# EAGLE design breakout_da14580 (EAGLE 7.4.0)
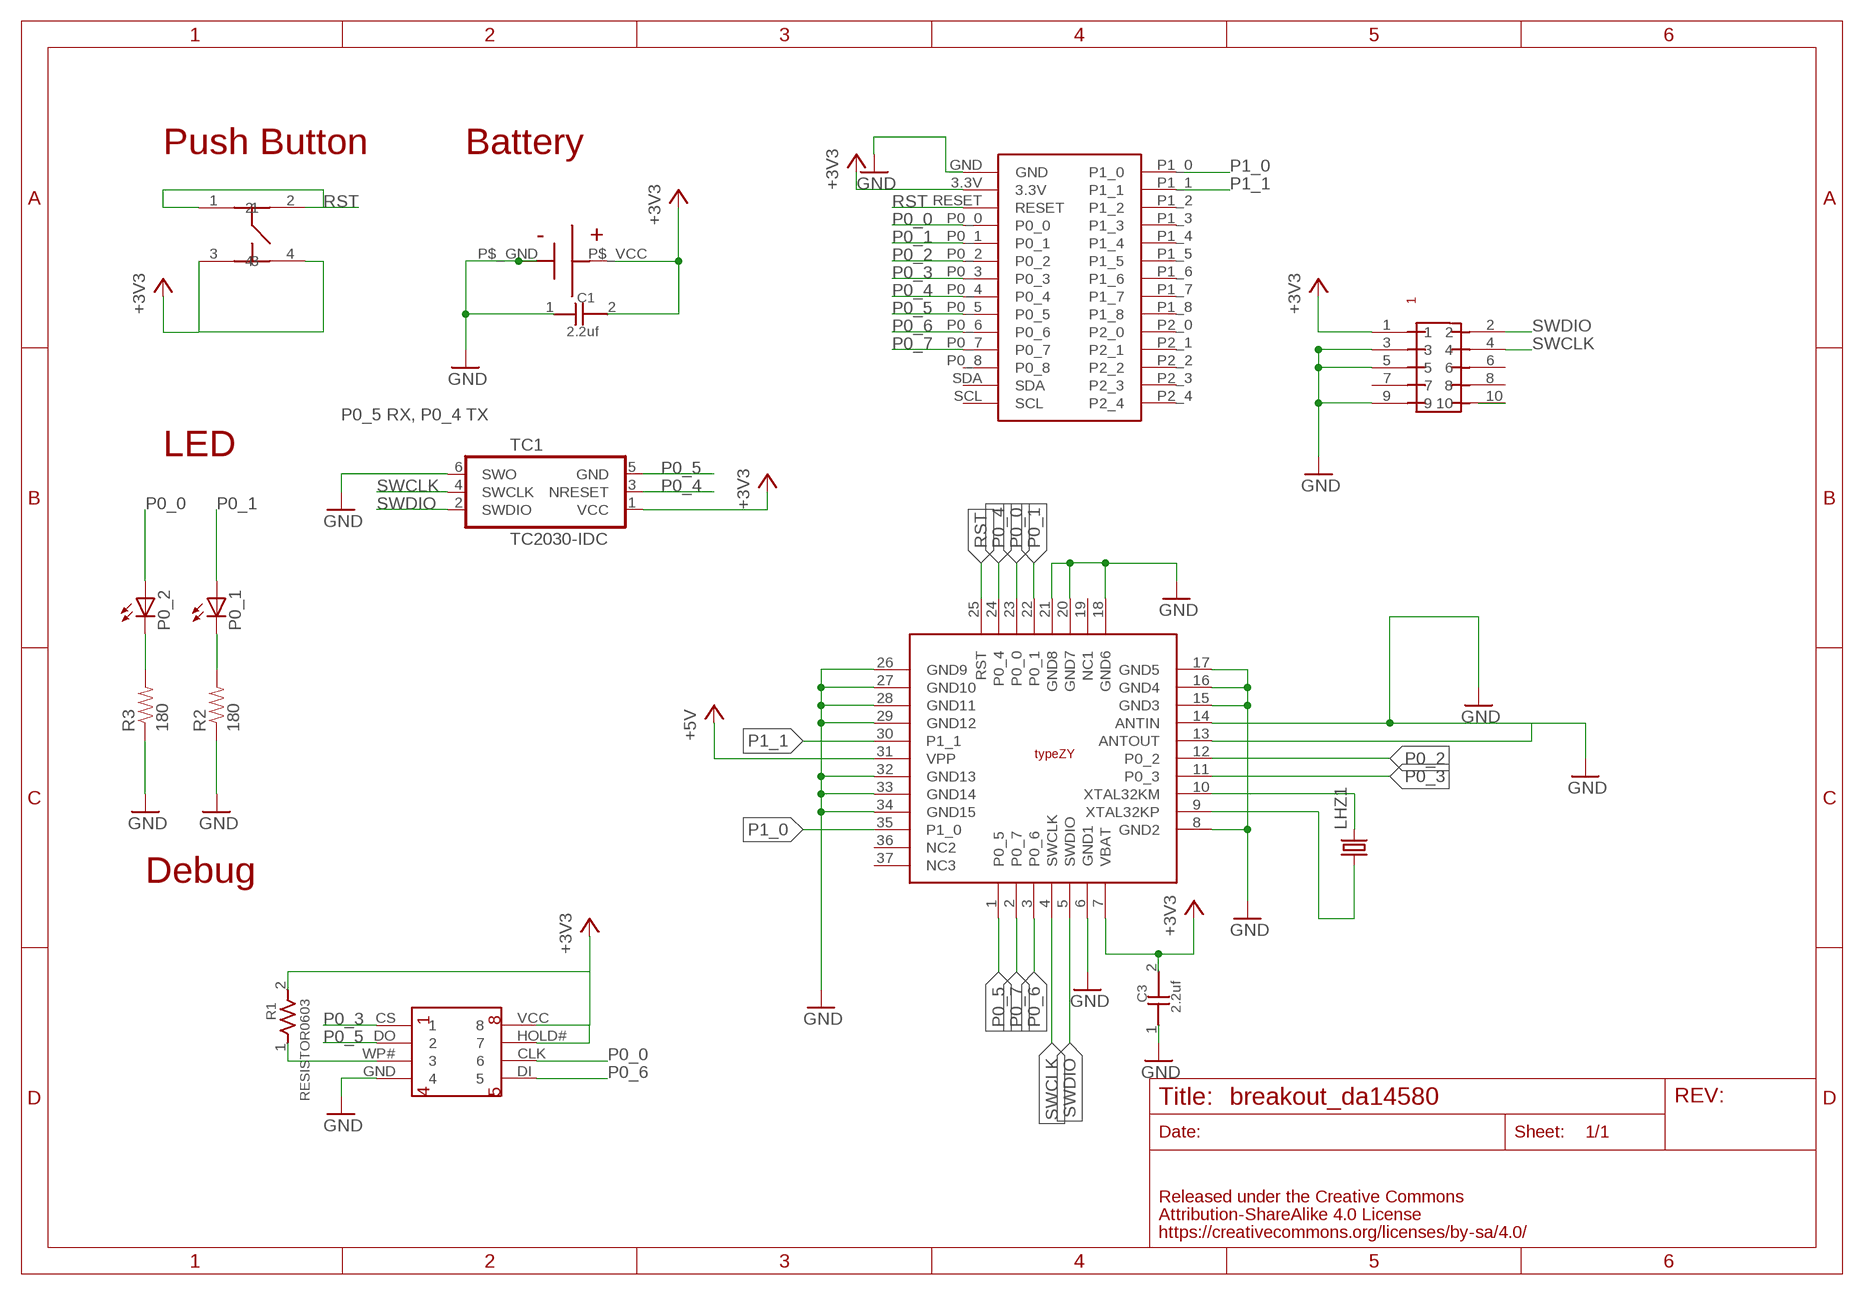
[diagram p0: schematic, sheet 1]

## Parts
C1  2.2uf  CAPACITOR0603  [0603]
C3  2.2uf  CAPACITOR0603  [0603]
LHZ1  FC-12M  [FC-12M]
P0_1  LEDCHIP-LED0603  [CHIP-LED0603]
P0_2  LEDCHIP-LED0603  [CHIP-LED0603]
R1  RESISTOR0603  [0603]
R2  180  RESISTOR0603-RES  [0603-RES]
R3  180  RESISTOR0603-RES  [0603-RES]
TC1  TC2030-IDC  [TC2030-IDC]
U$1  MURATA-TYPEZY  [MURATA_TYPEZY]
U$2  BREAKOUT_BLE  [BREAKOUT_BLE]
U$3  SMTU2450-TOP  [SMTU2450]
U$5  FLASH-MEMORY-2M(WINBOND)  [FLASH-MEMORY-2M(WINBOND)]
U$6  PIN-HEADER-SMT(1.27MM)2X5  [PIN-HEADER-SMT(1.27MM)2X5]
U$7  SWICTH-4P(KMR2)  [SWITCH-4P(KMR2)]

## Nets
+3V3: C1.2 C3.2 R1.2 TC1.1(VCC) U$1.7(VBAT) U$2.3.3V U$3.P$_VCC(+) U$5.HOLD# U$5.VCC U$6.1 U$7.3 U$7.4
+5V: U$1.31(VPP)
GND: C1.1 C3.1 R2.1 R3.1 TC1.6(SWO) U$1.6(GND1) U$1.8(GND2) U$1.14(ANTIN) U$1.15(GND3) U$1.16(GND4) U$1.17(GND5) U$1.18(GND6) U$1.20(GND7) U$1.21(GND8) U$1.26(GND9) U$1.27(GND10) U$1.28(GND11) U$1.29(GND12) U$1.32(GND13) U$1.33(GND14) U$1.34(GND15) U$2.GND U$3.P$_GND(-) U$5.GND U$6.3 U$6.5 U$6.9
LED1: P0_1.C R2.2
LED2: P0_2.C R3.2
N$1: U$1.13(ANTOUT)
N$2: R1.1 U$5.WP#
P0_0: P0_2.A U$1.23(P0_0) U$2.P0_0 U$5.CLK
P0_1: P0_1.A U$1.22(P0_1) U$2.P0_1
P0_2: U$1.12(P0_2) U$2.P0_2
P0_3: U$1.11(P0_3) U$2.P0_3 U$5.CS
P0_4: TC1.3(NRESET) U$1.24(P0_4) U$2.P0_4
P0_5: TC1.5(GND) U$1.1(P0_5) U$2.P0_5 U$5.DO
P0_6: U$1.3(P0_6) U$2.P0_6 U$5.DI
P0_7: U$1.2(P0_7) U$2.P0_7
P1_0: U$1.35(P1_0) U$2.P1_0
P1_1: U$1.30(P1_1) U$2.P1_1
RESET: U$6.10
RST: U$1.25(RST) U$2.RESET U$7.1 U$7.2
SWCLK: TC1.4(SWCLK) U$1.4(SWCLK) U$6.4
SWDIO: TC1.2(SWDIO) U$1.5(SWDIO) U$6.2
XTAL32KM: LHZ1.2 U$1.10(XTAL32KM)
XTAL32KP: LHZ1.1 U$1.9(XTAL32KP)
Unconnected: U$1.19(NC1) U$1.36(NC2) U$1.37(NC3) U$2.P0_8 U$2.P1_2 U$2.P1_3 U$2.P1_4 U$2.P1_5 U$2.P1_6 U$2.P1_7 U$2.P1_8 U$2.P2_0 U$2.P2_1 U$2.P2_2 U$2.P2_3 U$2.P2_4 U$2.SCL U$2.SDA U$6.6 U$6.7 U$6.8

## Notes on the sheet
- Push Button | Battery
- P0_5 RX, P0_4 TX
- LED
- Debug

## Library data of the parts
C1 C3 = GClue-Capacitor:CAPACITOR
LHZ1 = crystal:FC-12M: kHz RANGE CRYSTAL UNIT LOW PROFILE SMD Source: Epson Toyocom FC-12M.pdf
P0_1 P0_2 = led:LED: LED OSRAM: - CHIPLED LG R971, LG N971, LY N971, LG Q971, LY Q971, LO R971, LY R971 LH N974, LH R974 LS Q976, LO Q976, LY Q976 LO Q996 - Hyper CHIPLED LW Q18S LB Q993, LB Q99A, LB R99A - SideLED LS A670, LO A670, LY A670, LG A670, LP A670 LB A673, LV A673, LT A673, LW A673 LH A674 LY A675 LS A676, LA A676, LO A676, LY A676, LW A676 LS A679, LY A679, LG A679 - Hyper Micro SIDELED® LS Y876, LA Y876, LO Y876, LY Y876 LT Y87S - SmartLED LW L88C, LW L88S LB L89C, LB L89S, LG L890 LS L89K, LO L89K, LY L89K LS L896, LA L896, LO L896, LY L896 - TOPLED LS T670, LO T670, LY T670, LG T670, LP T670 LSG T670, LSP T670, LSY T670, LOP T670, LYG T670 LG T671, LOG T671, LSG T671 LB T673, LV T673, LT T673, LW T673 LH T674 LS T676, LA T676, LO T676, LY T676, LB T676, LH T676, LSB T676, LW T676 LB T67C, LV T67C, LT T67C, LS T67K, LO T67K, LY T67K, LW E67C LS E67B, LA E67B, LO E67B, LY E67B, LB E67C, LV E67C, LT E67C LW T67C LS T679, LY T679, LG T679 LS T770, LO T770, LY T770, LG T770, LP T770 LB T773, LV T773, LT T773, LW T773 LH T774 LS E675, LA E675, LY E675, LS T675 LS T776, LA T776, LO T776, LY T776, LB T776 LHGB T686 LT T68C, LB T68C - Hyper Mini TOPLED® LB M676 - Mini TOPLED Santana® LG M470 LS M47K, LO M47K, LY M47K Source: http://www.osram.convergy.de LUXEON: - LUMILED® LXK2-PW12-R00, LXK2-PW12-S00, LXK2-PW14-U00, LXK2-PW14-V00 LXK2-PM12-R00, LXK2-PM12-S00, LXK2-PM14-U00 LXK2-PE12-Q00, LXK2-PE12-R00, LXK2-PE12-S00, LXK2-PE14-T00, LXK2-PE14-U00 LXK2-PB12-K00, LXK2-PB12-L00, LXK2-PB12-M00, LXK2-PB14-N00, LXK2-PB14-P00, LXK2-PB14-Q00 LXK2-PR12-L00, LXK2-PR12-M00, LXK2-PR14-Q00, LXK2-PR14-R00 LXK2-PD12-Q00, LXK2-PD12-R00, LXK2-PD12-S00 LXK2-PH12-R00, LXK2-PH12-S00 LXK2-PL12-P00, LXK2-PL12-Q00, LXK2-PL12-R00 Source: www.luxeon.com KINGBRIGHT: KA-3528ASYC Source: www.kingbright.com
R1 = GClue-Resistors:RESISTOR
R2 R3 = SparkFun:RESISTOR: Resistor Basic schematic elements and footprints for 0603, 1206, and PTH resistors.
TC1 = TagConnect:TC2030-IDC: Tag-Connect In Circuit Programming & Debug Cable 6 Pin http://www.tag-connect.com
U$1 = GClueBT:MURATA-TYPEZY
U$2 = gclue:BREAKOUT_BLE
U$3 = GClue-Supply:SMTU2450-TOP
U$5 = gclue:FLASH-MEMORY-2M(WINBOND)
U$6 = gclue:PIN-HEADER-SMT(1.27MM)2X5: PIN-HEADER-SMT (1.27MM) 2x5
U$7 = gclue-test:SWICTH-4P(KMR2)

## Board
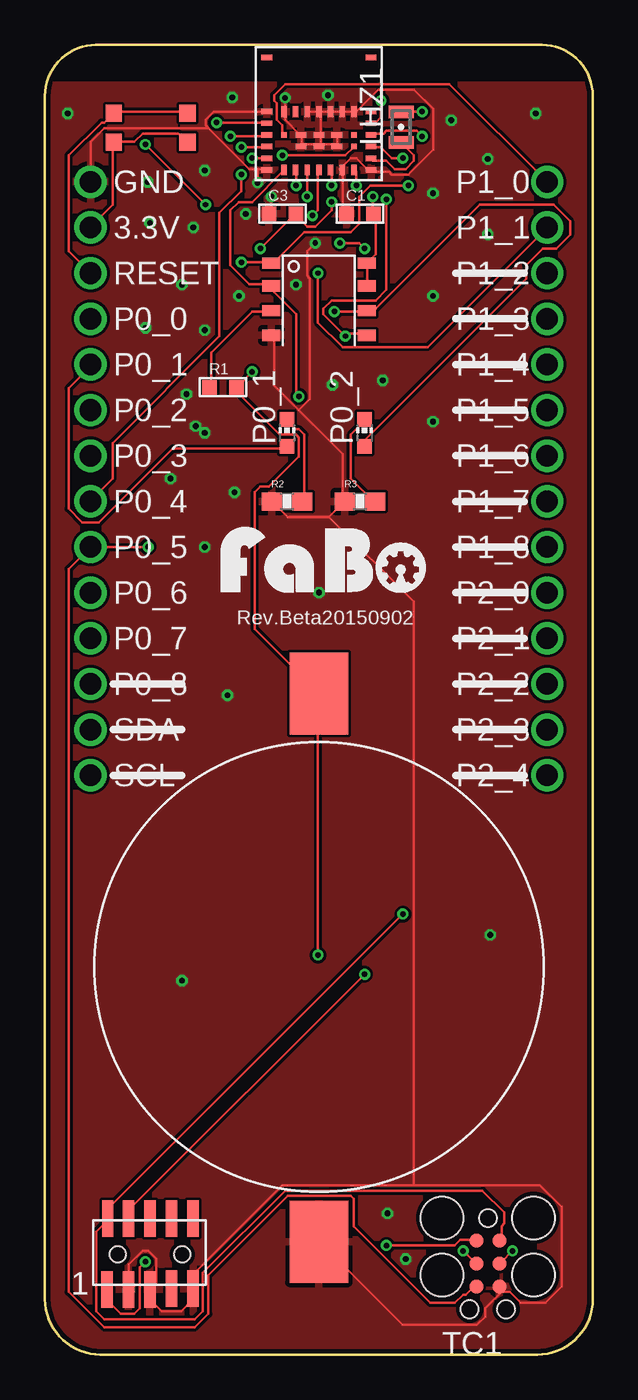
[diagram p1: board, top side]
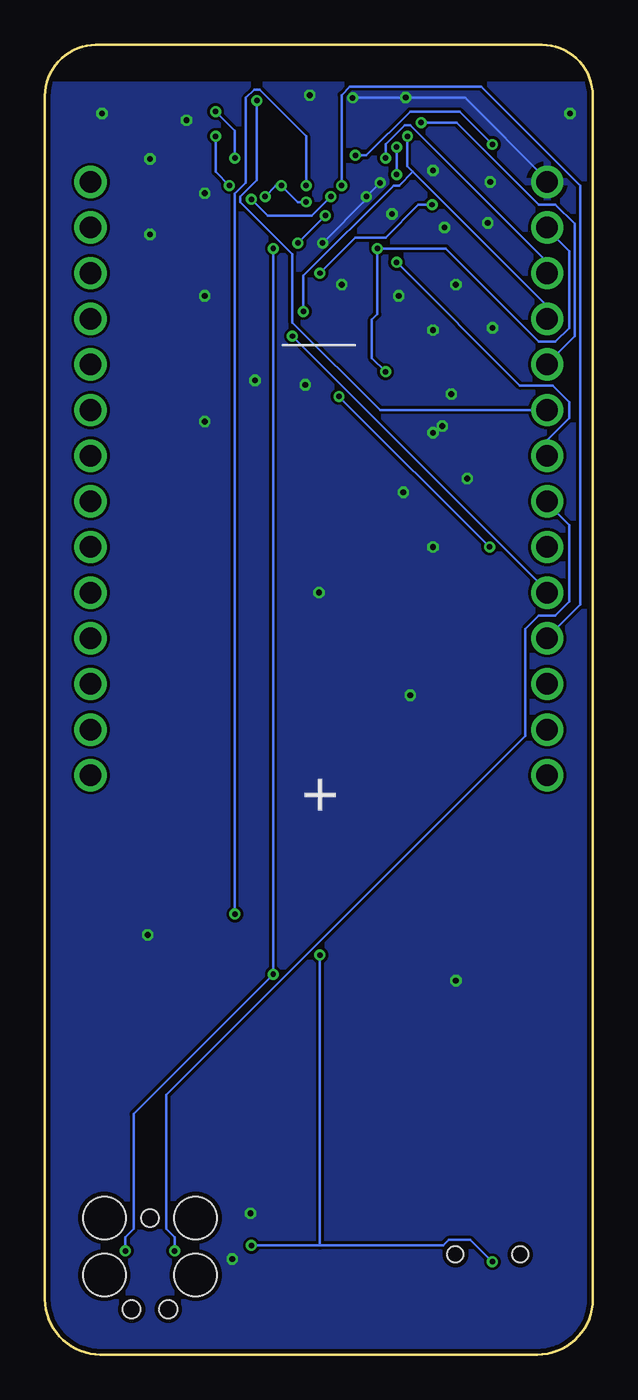
[diagram p2: board, bottom side, seen from below]

Size 30.48 x 72.88 mm. Coordinates in mm from the lower left corner, seen from the top.
Copper layers (1*16): Top 0.035mm / dielectric 1.5mm / Bottom 0.035mm
Design rules "SeeedStudio_2layer_DRU_no_angle_20140221": minimum track width 6mil, minimum drill 12mil, track to track 6mil, track to pad 6mil, pad to pad 6mil, via to via 6mil, smd to smd 0mil, copper to edge 10mil, drill to drill 10mil, minimum pad ring 10mil, minimum via ring 6mil, stop-mask expansion 2mil, vias tented up to drill 100mil, thermal gap 10mil
tRestrict: area -1,70.8 to 31.8,75.2
bRestrict: area -1,70.8 to 31.8,75.2

### Footprints (pad centres in the part's own frame; a part is rotated, then mirrored left to right if it is on the bottom)
0603 = smd 0.8 x 0.8: 1 -0.75,0; 2 0.75,0
FC-12M = smd 0.7 x 1.4: 1 -0.85,0; 2 0.85,0
CHIP-LED0603 = smd 0.8 x 0.8: A 0,-0.75; C 0,0.75
0603-RES = smd 1.1 x 1: 1 -0.85,0; 2 0.85,0
TC2030-IDC = smd 0.787 x 0.787: 1 -1.27,-0.635; 2 -1.27,0.635; 3 0,-0.635; 4 0,0.635; 5 1.27,-0.635; 6 1.27,0.635 | hole 0.991: -2.54,0; 2.54,1.016; 2.54,-1.016 | hole 2.375: -2.54,2.54; -2.54,-2.54; 0.635,2.54; 0.635,-2.54
MURATA_TYPEZY = smd 0.3 x 0.6: 1 -1.95,-1.625; 2 -1.3,-1.625; 3 -0.65,-1.625; 4 0,-1.625; 5 0.65,-1.625; 6 1.3,-1.625; 7 1.95,-1.625; 14 1.95,1.625; 15 1.3,1.625; 16 0.65,1.625; 17 0,1.625; 18 -0.65,1.625; 19 -1.3,1.625; 20 -1.95,1.625 | smd 0.6 x 0.3: 8 2.9,-1.625; 9 2.9,-0.975; 10 2.9,-0.325; 11 2.9,0.325; 12 2.9,0.975; 13 2.9,1.625; 21 -2.9,1.625; 22 -2.9,0.975; 23 -2.9,0.325; 24 -2.9,-0.325; 25 -2.9,-0.975; 26 -2.9,-1.625; 27 -1,-0.325; 28 0,-0.325; 29 1,-0.325; 32 1,0.325; 33 0,0.325; 34 -1,0.325; 36 2.9,4.625; 37 -2.9,4.625 | smd 0.3 x 0.3: 30 1.95,-0.325; 31 1.95,0.325; 35 -1.95,0.325
BREAKOUT_BLE = drill 1.2: 3.3V -12.7,10.16; GND -12.7,12.7; P0_0 -12.7,5.08; P0_1 -12.7,2.54; P0_2 -12.7,0; P0_3 -12.7,-2.54; P0_4 -12.7,-5.08; P0_5 -12.7,-7.62; P0_6 -12.7,-10.16; P0_7 -12.7,-12.7; P0_8 -12.7,-15.24; P1_0 12.7,12.7; P1_1 12.7,10.16; P1_2 12.7,7.62; P1_3 12.7,5.08; P1_4 12.7,2.54; P1_5 12.7,0; P1_6 12.7,-2.54; P1_7 12.7,-5.08; P1_8 12.7,-7.62; P2_0 12.7,-10.16; P2_1 12.7,-12.7; P2_2 12.7,-15.24; P2_3 12.7,-17.78; P2_4 12.7,-20.32; RESET -12.7,7.62; SCL -12.7,-20.32; SDA -12.7,-17.78
SMTU2450 = smd 3.251 x 4.572: P$_GND 0,-15.29; P$_VCC 0,15.21
FLASH-MEMORY-2M(WINBOND) = smd 1 x 0.635: CLK 2.67,0.2; CS -2.64,2.84; DI 2.67,-1.17; DO -2.64,1.57; GND -2.64,-1.17; HOLD# 2.67,1.57; VCC 2.67,2.84; WP# -2.64,0.2
PIN-HEADER-SMT(1.27MM)2X5 = smd 0.635 x 2.032: 1 -2.4,-1.95; 2 -2.35,2; 3 -1.2,-1.95; 4 -1.2,2; 5 0,-1.95; 6 0,2; 7 1.2,-1.9; 8 1.2,2; 9 2.4,-1.9; 10 2.4,2 | hole 0.9: 1.8,0; -1.8,0
SWITCH-4P(KMR2) = smd 0.9 x 0.95: 1 -1,0; 2 3.1,0; 3 -1,-1.6; 4 3.1,-1.6

### Placement (x,y rotation side)
C1  17.53,63.48 0 top
C3  13.21,63.48 0 top
LHZ1  19.81,68.31 90 top
P0_1  13.46,51.29 0 top
P0_2  17.78,51.29 0 top
R1  9.91,53.83 0 top
R2  13.46,47.48 0 top
R3  17.53,47.48 0 top
TC1  24.64,5.06 270 top
U$1  15.24,67.55 0 top
U$2  15.24,52.56 0 top
U$3  15.24,21.57 0 top
U$5  15.24,57.89 0 top
U$6  5.84,5.57 0 top
U$7  4.83,69.07 0 top
U$8  [LOGO_FABO_M]  15.49,42.4 0 top

### Tracks (layer width: path | path; a pad name or v marks a point on that pad's centre or on a via)
+3V3  (via drill 0.3)
  Top 0.152: U$5.HOLD# 17.93,59.57 17.93,60.64 U$5.VCC 17.93,60.79 18.39,61.25 18.39,63.38 C1.2 18.24,63.53 v18.24,64.45 | v17.32,65.06 17.32,65.82 U$1.7 | v15.95,64.14 15.95,63.69 15.04,62.77 14.58,62.77 13.97,63.38 C3.2 13.82,63.38 v11.99,61.55 | U$7.4 7.87,67.5 7.42,67.95 5.44,67.95 4.98,67.5 3.91,67.5 U$7.3 3.76,67.34 3.76,63.99 2.54,62.77 U$2.3.3V | v19,6.08 22.81,6.08 23.11,6.38 23.88,6.38 TC1.1 | v5.59,5.16 5.28,4.86 5.28,2.57 4.98,2.27 4.22,2.27 3.45,3.03 3.45,3.49 U$6.1 | v15.19,22.23 15.19,36.71 U$3.P$_VCC 15.19,36.86 11.68,40.37 11.68,47.99 11.99,48.29 12.45,48.29 14.12,49.97 14.12,51.04 13.97,51.19 13.06,51.19 10.77,53.47 10.77,53.78 R1.2 10.77,53.93 v11.53,54.69
  Bottom 0.152: v18.24,64.45 17.63,65.06 v17.32,65.06 16.41,64.14 v15.95,64.14 | U$2.3.3V 2.54,62.62 1.32,61.4 1.32,57.13 2.08,56.37 3,56.37 8.18,61.55 v11.99,61.55 11.99,57.89 12.29,57.59 12.29,55.46 v11.53,54.69 | 15.19,6.08 8.33,6.08 8.03,6.38 6.81,6.38 v5.59,5.16 | 15.19,6.08 v19,6.08 | v15.19,22.23 15.19,6.08
GND  (via drill 0.3, 0.32)
  Top 0.152: U$6.3 4.67,3.64 4.67,5.01 5.44,5.77 5.74,5.77 6.2,5.32 6.2,3.94 5.89,3.64 U$6.5 5.89,3.49 5.89,3.03 6.5,2.42 7.57,2.42 8.18,3.03 8.18,3.64 U$6.9 8.33,3.79 8.33,4.55 13.21,9.43 20.52,9.43 | 25.4,3.49 25.4,3.79 TC1.6 25.4,3.49 | 25.4,3.49 24.49,2.57 24.49,2.12 24.03,1.66 19.91,1.66 15.34,6.23 U$3.P$_GND | 20.52,9.43 27.53,9.43 28.75,8.21 28.75,3.79 27.84,2.88 26.47,2.88 25.86,3.49 25.4,3.49 | 14.12,52.56 16.56,50.12 16.56,47.53 R3.1 16.56,47.38 15.8,46.62 | 14.12,52.56 12.75,53.93 12.75,56.67 U$5.GND | 15.8,46.62 13.51,46.62 12.75,47.38 R2.1 | C1.1 16.71,63.53 16.56,63.69 16.56,65.82 U$1.6 16.41,65.97 17.02,66.58 17.32,66.58 17.93,65.97 18.09,65.97 U$1.8 18.24,65.82 19.15,65.82 19.3,65.67 20.22,65.67 21.59,67.04 21.59,69.32 20.52,70.39 18.54,70.39 17.32,69.17 U$1.14 17.17,69.17 16.56,69.17 U$1.15 16.41,69.17 15.95,69.17 U$1.16 15.8,69.17 15.34,69.17 U$1.17 | U$1.18 14.73,69.17 15.19,69.17 U$1.17 | 15.34,67.34 15.34,67.8 U$1.33 15.34,67.95 15.34,69.02 U$1.17 | U$1.32 16.26,67.8 16.26,67.34 U$1.29 16.1,67.34 15.34,67.34 | 15.34,67.34 U$1.28 15.19,67.34 14.27,67.34 | 14.27,67.34 14.27,67.8 U$1.34 14.12,67.95 13.36,68.71 13.36,69.02 U$1.20 13.36,69.17 v13.36,69.93 | 14.27,67.34 U$1.27 | 11.84,65.97 11.38,65.97 9.09,68.26 | 11.84,65.97 12.29,65.97 U$1.26 | 9.09,68.26 8.94,68.41 8.94,68.71 9.4,69.17 12.29,69.17 U$1.21 | v12.6,64.45 12.6,63.53 C3.1 | 11.84,65.97 v11.84,65.21 | U$2.GND 2.54,67.5 3.3,68.26 9.09,68.26 | 14.12,52.56 14.73,53.17 14.73,59.88 14.58,60.03 14.58,61.4 v15.04,61.86 | 20.52,9.43 20.52,41.89 15.8,46.62
  Bottom 0.152: v11.84,65.21 v12.6,64.45 12.6,64.3 v15.04,61.86 | v13.36,69.93 7.11,69.93 2.54,65.36 U$2.GND
  other vias: 8.89,44.94 10.16,36.69 15.24,42.4 7.62,20.81 24.77,23.35 21.59,58.91 6.98,48.75 8.89,51.29 10.79,58.91 7.62,59.55 8.89,57 8.25,62.72 8.89,65.89 1.27,69.07 5.71,65.26 13.97,59.55 21.59,64.62 27.3,69.07 10.41,69.96 22.61,68.69 24.64,62.34 7.87,53.45 8.38,51.67 21.59,51.92 18.8,54.21 16,53.96 5.84,62.97 5.59,57.13 11.18,63.48 10.54,47.99 24.64,66.53 15.75,70.09 19.05,7.86 20.07,5.32
  pour Top: -1.27,-0.78 31.75,-0.78 31.75,72.88 -1.27,72.88
  pour Bottom: -1.27,-0.78 31.75,-0.78 31.75,72.88 -1.27,72.88
LED1
  Top 0.152: P0_1.C 13.51,51.95 13.97,51.49 14.12,51.49 14.43,51.19 14.43,47.53 R2.2
LED2
  Top 0.152: P0_2.C 17.78,51.95 17.02,51.19 17.02,48.75 18.24,47.53 R3.2
N$2
  Top 0.152: R1.1 9.25,53.93 9.25,55.76 11.53,58.05 12.6,58.05 U$5.WP#
P0_0  (via drill 0.3)
  Top 0.152: P0_2.A 17.78,50.88 26.77,59.88 26.77,60.64 27.69,61.55 28.45,61.55 29.21,62.31 29.21,63.08 28.3,63.99 24.18,63.99 18.39,58.2 17.93,58.2 U$5.CLK 17.78,58.05 v16.1,58.05 | v10.31,67.8 12.29,67.8 U$1.23
  Bottom 0.152: v10.31,67.8 10.31,66.12 10.01,65.82 | 10.01,65.82 2.54,58.35 U$2.P0_0 | v16.1,58.05 16.1,60.03 11.07,65.06 10.77,65.06 10.01,65.82
P0_1  (via drill 0.3)
  Top 0.152: v9.55,68.56 12.29,68.56 U$1.22 | P0_1.A 13.36,50.43 7.11,50.43 3,46.31 2.08,46.31 1.32,47.07 1.32,53.78 2.54,55 U$2.P0_1
  Bottom 0.152: v9.55,68.56 7.57,68.56 3,63.99 2.08,63.99 1.02,62.92 1.02,56.67 2.54,55.15 U$2.P0_1
P0_2  (via drill 0.3)
  Top 0.152: v18.69,69.78 18.69,68.87 18.39,68.56 18.24,68.56 U$1.12
  Bottom 0.152: v18.69,69.78 18.69,65.36 19.61,64.45 19.61,64.14 16.71,61.25 16.71,57.44 11.84,52.56 U$2.P0_2
P0_3  (via drill 0.3)
  Top 0.152: v20.98,67.8 20.68,68.11 19,68.11 18.85,67.95 18.24,67.95 U$1.11 | v20.22,65.06 18.09,65.06 17.48,64.45 17.48,62.92 17.02,62.47 14.43,62.47 12.75,60.79 U$5.CS 12.6,60.79 v10.92,60.79
  Bottom 0.152: v20.98,67.8 20.98,65.82 v20.22,65.06 | U$2.P0_3 2.54,50.88 1.32,52.1 1.32,53.02 2.23,53.93 4.06,53.93 v10.92,60.79
P0_4  (via drill 0.3)
  Top 0.152: v10.92,67.19 12.29,67.19 U$1.24 | v10.92,65.67 10.92,64.75 9.7,63.53 9.7,56.67 3.76,50.73 3.76,48.75 2.54,47.53 U$2.P0_4 | v23.27,5.77 23.88,5.16 TC1.3
  Bottom 0.152: v10.92,65.67 v10.92,67.19 | v23.27,5.77 23.27,6.53 23.72,6.99 23.72,14.46 3.76,34.42 3.76,40.37 3,41.13 2.08,41.13 1.32,41.89 1.32,46.16 2.54,47.38 U$2.P0_4
P0_5  (via drill 0.3)
  Top 0.152: U$1.1 13.21,65.82 11.53,64.14 10.77,64.14 10.31,63.69 10.31,60.64 11.38,59.57 12.6,59.57 U$5.DO 12.75,59.42 12.75,59.11 13.97,57.89 13.97,53.47 v14.12,53.32 | TC1.5 23.88,3.79 23.42,3.33 23.27,3.33 22.81,2.88 21.44,2.88 17.17,7.14 17.17,8.67 17.02,8.82 13.51,8.82 9.09,4.4 9.09,2.27 8.33,1.51 3.3,1.51 1.32,3.49 1.32,43.72 U$2.P0_5 v5.74,44.94
  Bottom 0.152: v5.74,44.94 v14.12,53.32
P0_6  (via drill 0.3)
  Top 0.152: v14.58,64.45 14.58,65.82 U$1.3 | v19,64.3 19,59.27 18.39,58.66 15.95,58.66 15.49,58.2 15.49,57.89 16.56,56.83 16.71,56.83 | 16.71,56.83 17.78,56.83 U$5.DI | 16.71,56.83 v16.71,56.67
  Bottom 0.152: v14.58,64.45 15.65,63.38 18.09,63.38 v19,64.3 | v16.71,56.67 2.54,42.5 U$2.P0_6
P0_7  (via drill 0.3)
  Top 0.152: v13.97,65.06 13.97,65.82 U$1.2
  Bottom 0.152: v13.97,65.06 13.97,70.09 13.51,70.54 6.2,70.54 0.71,65.06 0.71,41.74 2.54,39.91 U$2.P0_7
P1_0
  Top 0.152: U$2.P1_0 22.5,70.7 13.36,70.7 12.75,70.09 12.75,69.78 12.9,69.63 12.9,68.71 13.21,68.41 13.21,67.95 U$1.35
P1_1  (via drill 0.3)
  Top 0.152: v13.21,66.73 16.71,66.73 17.17,67.19 U$1.30 | v8.94,63.99 v5.59,67.34 | v15.19,60.18 15.19,57.44 16.56,56.06 21.28,56.06 U$2.P1_1
  Bottom 0.152: v13.21,66.73 12.6,66.73 10.16,69.17 7.42,69.17 v5.59,67.34 | v8.94,63.99 9.7,63.99 11.53,62.16 13.21,62.16 v15.19,60.18
RST  (via drill 0.3)
  Top 0.152: U$7.2 7.87,69.17 3.91,69.17 U$7.1 3.76,69.02 3.3,68.56 3.15,68.56 1.32,66.73 1.32,61.4 U$2.RESET | v11.53,66.58 12.29,66.58 U$1.25
  Bottom 0.152: v11.53,66.58 11.53,67.34 10.46,68.41 10.16,68.41 2.54,60.79 U$2.RESET
SWCLK  (via drill 0.3)
  Top 0.152: v14.88,63.38 15.19,63.69 15.19,65.82 U$1.4 | v16.41,61.86 17.48,61.86 v17.78,61.55 | v17.78,21.17 4.67,8.06 4.67,7.6 U$6.4 | v26.01,5.77 25.4,5.16 TC1.4
  Bottom 0.152: v16.41,61.86 v14.88,63.38 | v17.78,61.55 v17.78,21.17 25.55,13.39 25.55,6.99 26.01,6.53 v26.01,5.77
SWDIO  (via drill 0.3)
  Top 0.152: v15.95,65.06 15.95,65.82 U$1.5 | v19.91,24.52 3.61,8.21 3.61,7.6 U$6.2 3.45,7.45 2.84,6.84 2.84,2.42 3.3,1.96 8.33,1.96 8.79,2.42 8.79,4.55 13.36,9.13 24.33,9.13 25.55,7.91 25.55,7.3 25.4,7.14 25.4,6.38 TC1.2
  Bottom 0.152: v15.95,65.06 15.95,67.8 18.54,70.39 18.85,70.39 19.3,69.93 19.3,65.21 19.91,64.6 v19.91,24.52
XTAL32KM  (via drill 0.3)
  Top 0.152: v19.91,66.58 19.3,66.58 18.69,67.19 18.24,67.19 U$1.10 | v20.98,69.17 19.91,69.17 LHZ1.2
  Bottom 0.152: v19.91,66.58 19.91,68.11 v20.98,69.17
XTAL32KP
  Top 0.152: U$1.9 18.24,66.43 19,66.43 19.46,65.97 20.07,65.97 20.52,66.43 20.52,66.73 19.91,67.34 LHZ1.1

### Text on the board
tPlace: Rev.Beta20150902